# EAGLE design PWR (EAGLE 6.4)
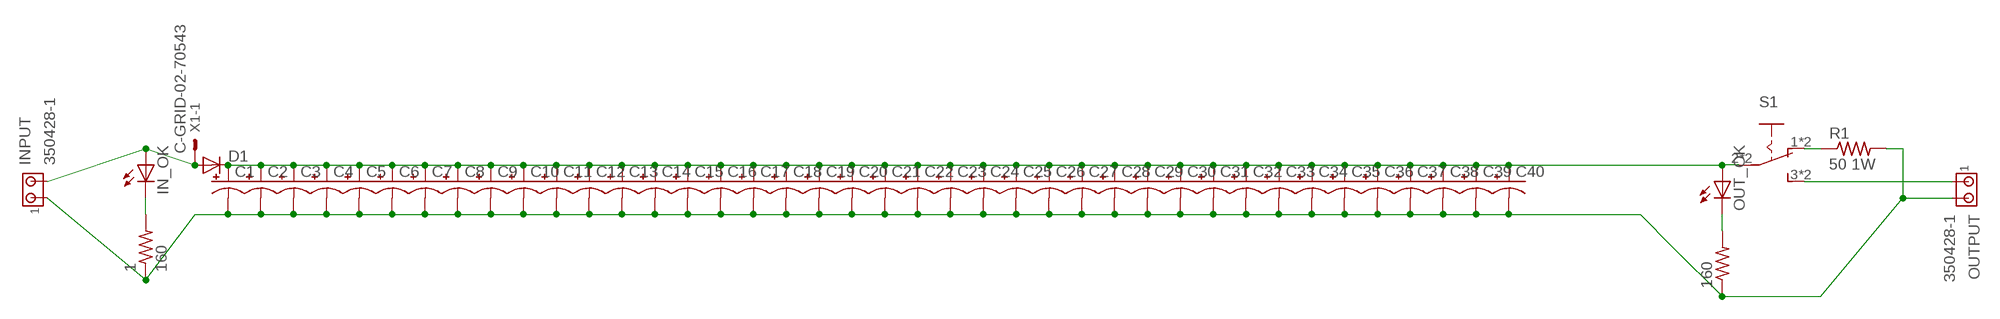
[diagram p0: schematic, sheet 1]

## Parts
1  160  R-US_R1206  [R1206]
160  R-US_R1206  [R1206]
C1  CPOL-USE5-10.5  [E5-10,5]
C2  CPOL-USE5-10.5  [E5-10,5]
C3  CPOL-USE5-10.5  [E5-10,5]
C4  CPOL-USE5-10.5  [E5-10,5]
C5  CPOL-USE5-10.5  [E5-10,5]
C6  CPOL-USE5-10.5  [E5-10,5]
C7  CPOL-USE5-10.5  [E5-10,5]
C8  CPOL-USE5-10.5  [E5-10,5]
C9  CPOL-USE5-10.5  [E5-10,5]
C10  CPOL-USE5-10.5  [E5-10,5]
C11  CPOL-USE5-10.5  [E5-10,5]
C12  CPOL-USE5-10.5  [E5-10,5]
C13  CPOL-USE5-10.5  [E5-10,5]
C14  CPOL-USE5-10.5  [E5-10,5]
C15  CPOL-USE5-10.5  [E5-10,5]
C16  CPOL-USE5-10.5  [E5-10,5]
C17  CPOL-USE5-10.5  [E5-10,5]
C18  CPOL-USE5-10.5  [E5-10,5]
C19  CPOL-USE5-10.5  [E5-10,5]
C20  CPOL-USE5-10.5  [E5-10,5]
C21  CPOL-USE5-10.5  [E5-10,5]
C22  CPOL-USE5-10.5  [E5-10,5]
C23  CPOL-USE5-10.5  [E5-10,5]
C24  CPOL-USE5-10.5  [E5-10,5]
C25  CPOL-USE5-10.5  [E5-10,5]
C26  CPOL-USE5-10.5  [E5-10,5]
C27  CPOL-USE5-10.5  [E5-10,5]
C28  CPOL-USE5-10.5  [E5-10,5]
C29  CPOL-USE5-10.5  [E5-10,5]
C30  CPOL-USE5-10.5  [E5-10,5]
C31  CPOL-USE5-10.5  [E5-10,5]
C32  CPOL-USE5-10.5  [E5-10,5]
C33  CPOL-USE5-10.5  [E5-10,5]
C34  CPOL-USE5-10.5  [E5-10,5]
C35  CPOL-USE5-10.5  [E5-10,5]
C36  CPOL-USE5-10.5  [E5-10,5]
C37  CPOL-USE5-10.5  [E5-10,5]
C38  CPOL-USE5-10.5  [E5-10,5]
C39  CPOL-USE5-10.5  [E5-10,5]
C40  CPOL-USE5-10.5  [E5-10,5]
D1  DIODE-SOD123  [SOD123]
IN_OK  LEDCHIPLED_1206  [CHIPLED_1206]
INPUT  350428-1  [350428-1]
OUT_OK  LEDCHIPLED_1206  [CHIPLED_1206]
OUTPUT  350428-1  [350428-1]
R1  50 1W  R-US_WSC2515  [WSC2515]
S1  M251  [SLIDE_SWITCH]
X1  C-GRID-02-70543  [70543-02]

## Nets
5V: C1.+ C2.+ C3.+ C4.+ C5.+ C6.+ C7.+ C8.+ C9.+ C10.+ C11.+ C12.+ C13.+ C14.+ C15.+ C16.+ C17.+ C18.+ C19.+ C20.+ C21.+ C22.+ C23.+ C24.+ C25.+ C26.+ C27.+ C28.+ C29.+ C30.+ C31.+ C32.+ C33.+ C34.+ C35.+ C36.+ C37.+ C38.+ C39.+ C40.+ D1.C OUT_OK.A S1.2(P) S1.5(P)
GND: 1.1 160.1 C1.- C2.- C3.- C4.- C5.- C6.- C7.- C8.- C9.- C10.- C11.- C12.- C13.- C14.- C15.- C16.- C17.- C18.- C19.- C20.- C21.- C22.- C23.- C24.- C25.- C26.- C27.- C28.- C29.- C30.- C31.- C32.- C33.- C34.- C35.- C36.- C37.- C38.- C39.- C40.- INPUT.1 OUTPUT.2 R1.2
N$1: R1.1 S1.1(O) S1.6(O)
N$2: 1.2 IN_OK.C
N$4: 160.2 OUT_OK.C
N$5: OUTPUT.1 S1.3(S) S1.4(S)
N$6: D1.A IN_OK.A INPUT.2 X1.1
Unconnected: X1.2

## Library data of the parts
1 160 R1 = rcl:R-US_: RESISTOR, American symbol
C1-C40 = rcl:CPOL-US: POLARIZED CAPACITOR, American symbol
D1 = diode:DIODE-: DIODE
IN_OK OUT_OK = led:LED: LED OSRAM: - CHIPLED LG R971, LG N971, LY N971, LG Q971, LY Q971, LO R971, LY R971 LH N974, LH R974 LS Q976, LO Q976, LY Q976 LO Q996 - Hyper CHIPLED LW Q18S LB Q993, LB Q99A, LB R99A - SideLED LS A670, LO A670, LY A670, LG A670, LP A670 LB A673, LV A673, LT A673, LW A673 LH A674 LY A675 LS A676, LA A676, LO A676, LY A676, LW A676 LS A679, LY A679, LG A679 - Hyper Micro SIDELED® LS Y876, LA Y876, LO Y876, LY Y876 LT Y87S - SmartLED LW L88C, LW L88S LB L89C, LB L89S, LG L890 LS L89K, LO L89K, LY L89K LS L896, LA L896, LO L896, LY L896 - TOPLED LS T670, LO T670, LY T670, LG T670, LP T670 LSG T670, LSP T670, LSY T670, LOP T670, LYG T670 LG T671, LOG T671, LSG T671 LB T673, LV T673, LT T673, LW T673 LH T674 LS T676, LA T676, LO T676, LY T676, LB T676, LH T676, LSB T676, LW T676 LB T67C, LV T67C, LT T67C, LS T67K, LO T67K, LY T67K, LW E67C LS E67B, LA E67B, LO E67B, LY E67B, LB E67C, LV E67C, LT E67C LW T67C LS T679, LY T679, LG T679 LS T770, LO T770, LY T770, LG T770, LP T770 LB T773, LV T773, LT T773, LW T773 LH T774 LS E675, LA E675, LY E675, LS T675 LS T776, LA T776, LO T776, LY T776, LB T776 LHGB T686 LT T68C, LB T68C - Hyper Mini TOPLED® LB M676 - Mini TOPLED Santana® LG M470 LS M47K, LO M47K, LY M47K Source: http://www.osram.convergy.de LUXEON: - LUMILED® LXK2-PW12-R00, LXK2-PW12-S00, LXK2-PW14-U00, LXK2-PW14-V00 LXK2-PM12-R00, LXK2-PM12-S00, LXK2-PM14-U00 LXK2-PE12-Q00, LXK2-PE12-R00, LXK2-PE12-S00, LXK2-PE14-T00, LXK2-PE14-U00 LXK2-PB12-K00, LXK2-PB12-L00, LXK2-PB12-M00, LXK2-PB14-N00, LXK2-PB14-P00, LXK2-PB14-Q00 LXK2-PR12-L00, LXK2-PR12-M00, LXK2-PR14-Q00, LXK2-PR14-R00 LXK2-PD12-Q00, LXK2-PD12-R00, LXK2-PD12-S00 LXK2-PH12-R00, LXK2-PH12-S00 LXK2-PL12-P00, LXK2-PL12-Q00, LXK2-PL12-R00 Source: www.luxeon.com KINGBRIGHT: KA-3528ASYC Source: www.kingbright.com
INPUT OUTPUT = con-amp:350428-1: Universal MATE-N-LOK .250" Centerline, 600 V, 19 - 36 A max Source: http://catalog.tycoelectronics.com/ .. ENG_CD_350428_Y.pdf
S1 = SolarJackets_Common:M251: SLIDING SWITCH Mors, distributor Buerklin, 11G702
X1 = con-molex:C-GRID-02: CONNECTOR wire to board 2.54 mm (0.100") pitch header; OC_FARNELL: unknown; OC_NEWARK: unknown

## Board
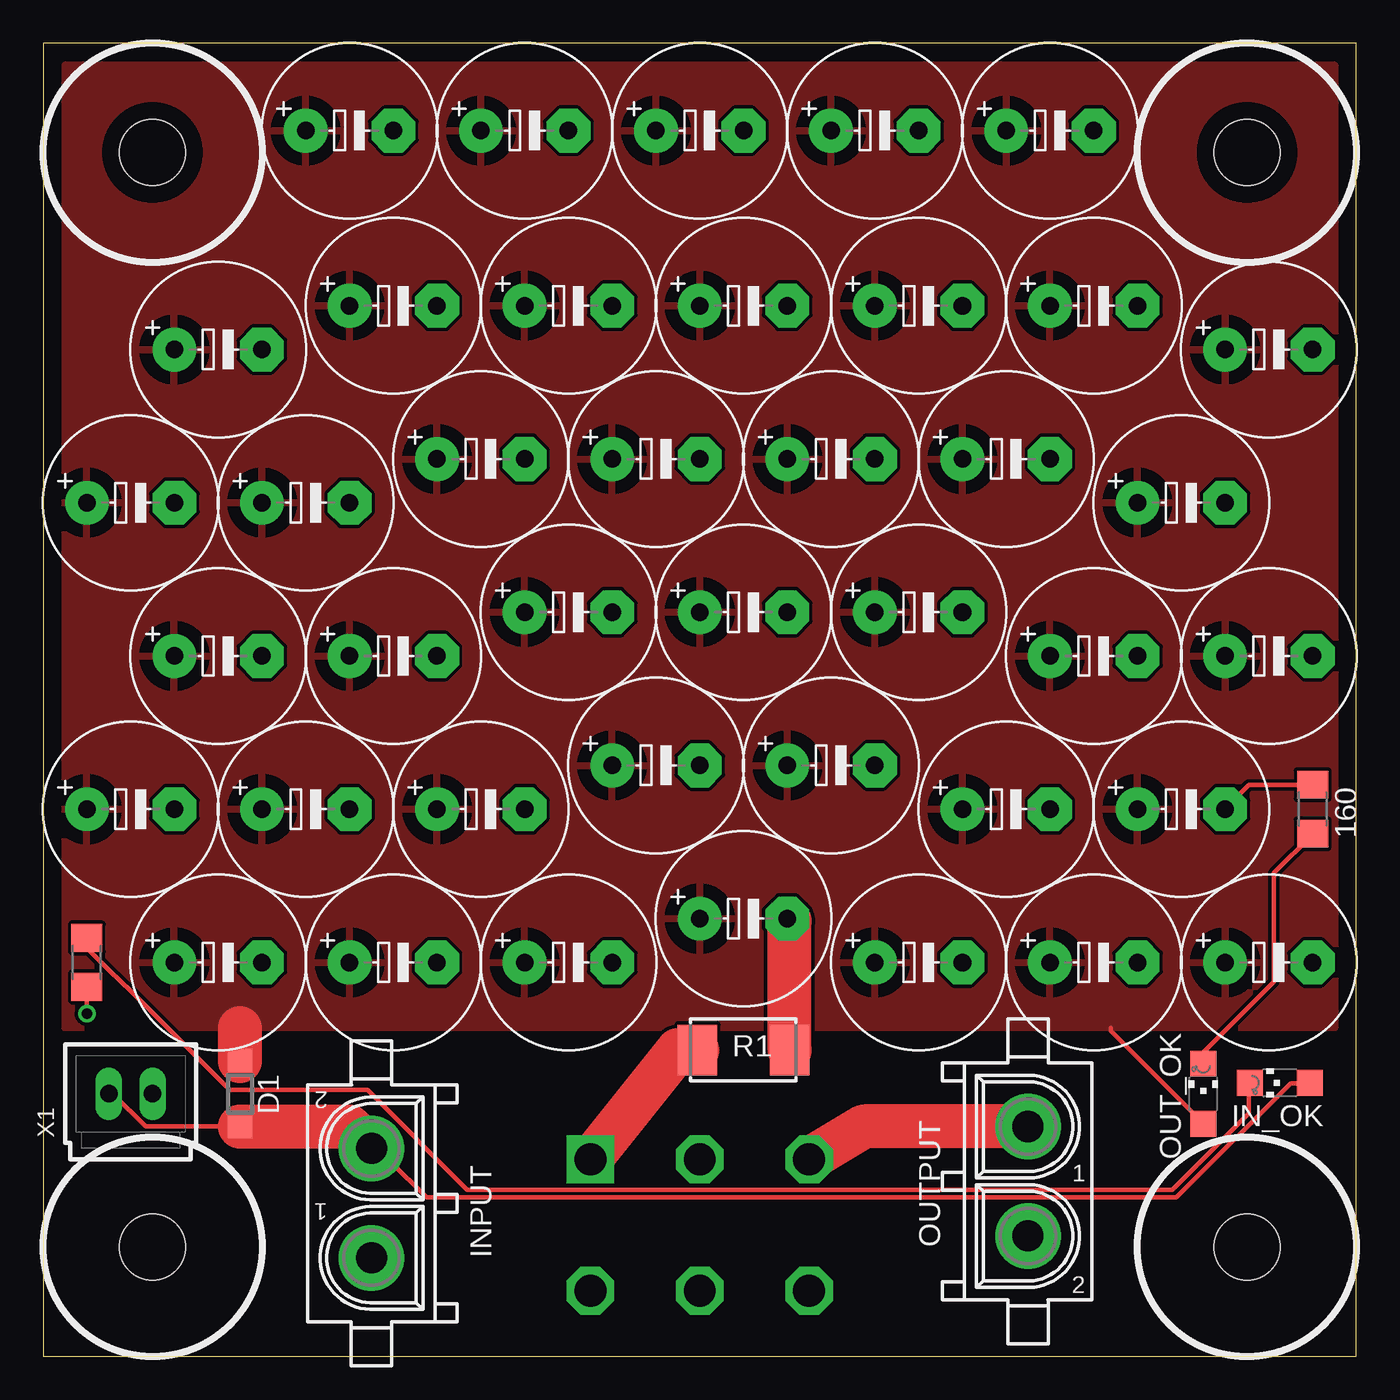
[diagram p1: board, top side]
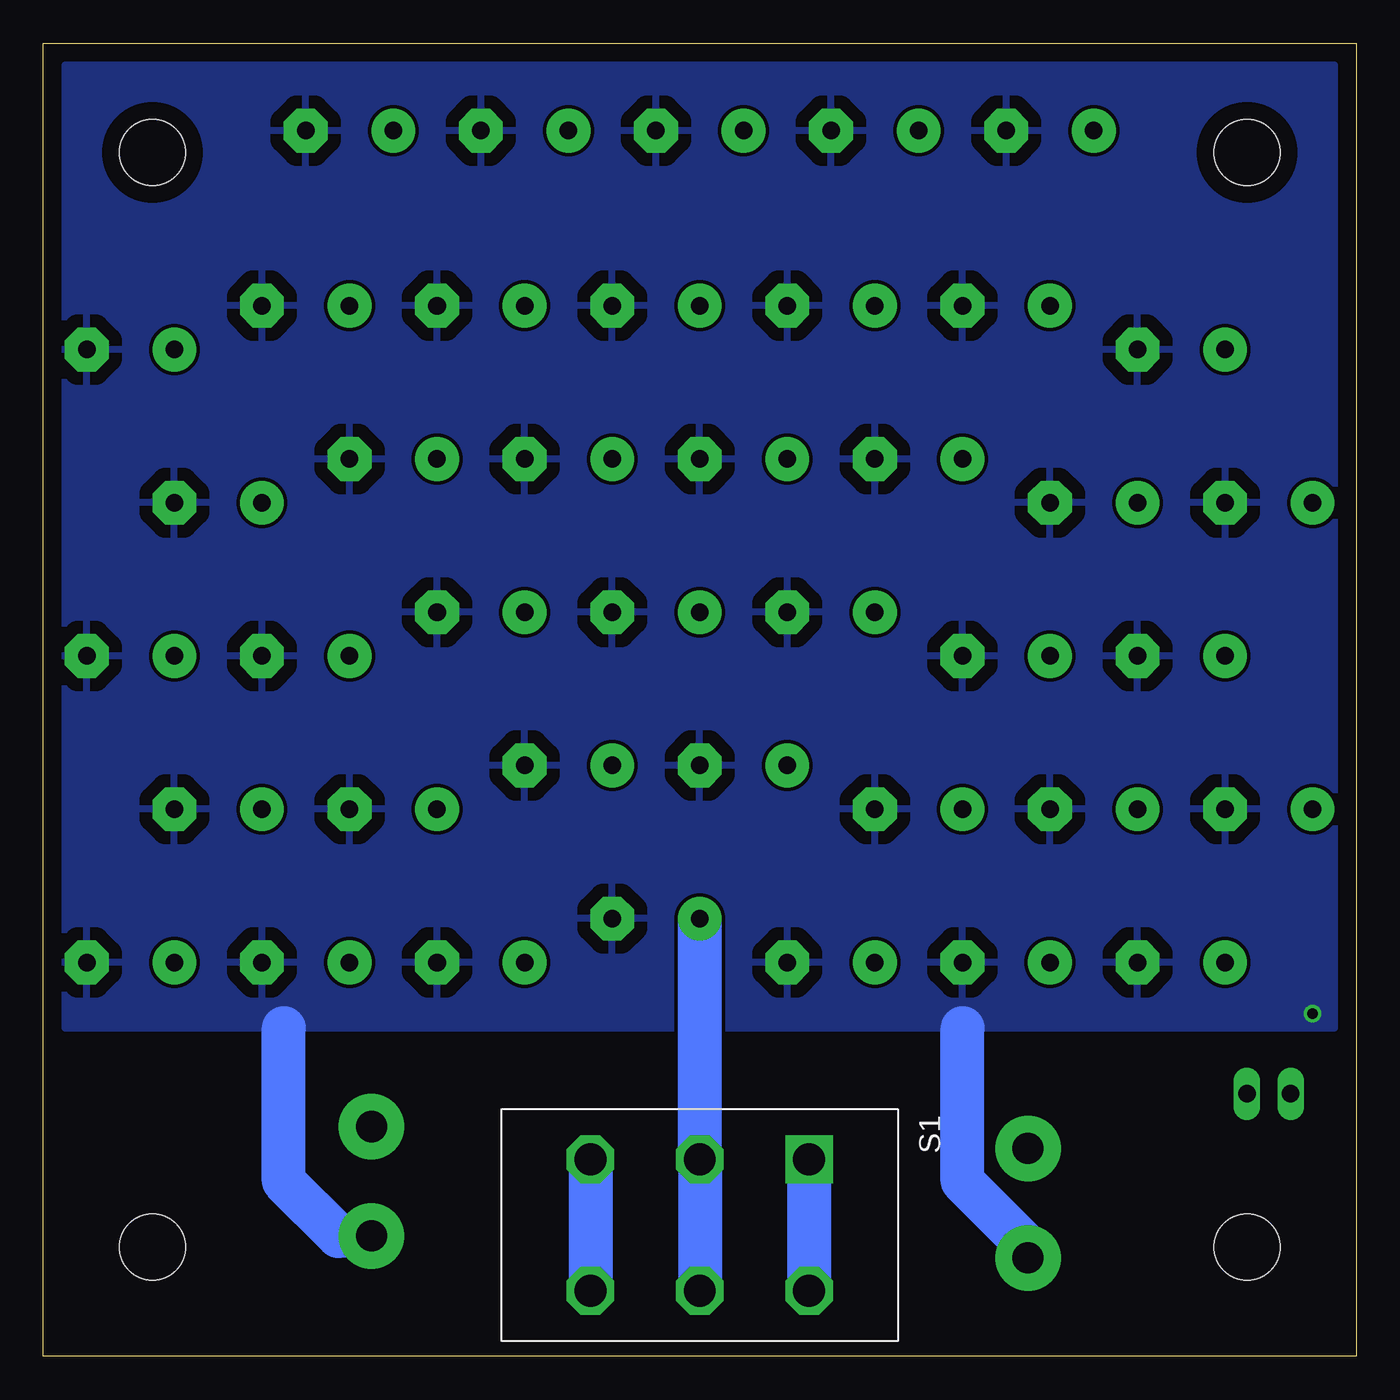
[diagram p2: board, bottom side, seen from below]

Size 76.2 x 76.2 mm. Coordinates in mm from the lower left corner, seen from the top.
Outline: 0,0 76.2,0 76.2,76.2 0,76.2 0,0
Copper layers (1*16): Top 0.035mm / dielectric 1.5mm / Bottom 0.035mm
Design rules "default *": minimum track width 10mil, minimum drill 24mil, track to track 8mil, track to pad 8mil, pad to pad 8mil, via to via 8mil, smd to smd 8mil, copper to edge 40mil, drill to drill 8mil, minimum pad ring 10mil, minimum via ring 8mil, stop-mask expansion 4mil, vias tented up to drill 0mil, thermal gap 30mil
Holes 3.81 mm at 6.35,6.35 6.35,69.85 69.85,69.85 69.85,6.35

### Footprints (pad centres in the part's own frame; a part is rotated, then mirrored left to right if it is on the bottom)
R1206 = smd 1.6 x 1.803: 1 -1.422,0; 2 1.422,0
E5-10,5 = drill 1.016 pad 2.54: + -2.54,0 | drill 1.016 pad 2.54 octagon: - 2.54,0
SOD123 = smd 1.4 x 1.4: A 1.9,0; C -1.9,0
CHIPLED_1206 = smd 1.5 x 1.5: A 0,-1.75; C 0,1.75
350428-1 = drill 1.8 pad 3.81: 1 -3.175,0; 2 3.175,0
WSC2515 = smd 2.29 x 2.92: 1 -2.675,0; 2 2.675,0
SLIDE_SWITCH = drill 1.854 square: 1 -3.81,6.35 | drill 1.854 octagon: 2 -3.81,0; 3 -3.81,-6.35; 4 3.81,-6.35; 5 3.81,0; 6 3.81,6.35
70543-02 = drill 1.016 long: 1 -1.27,0; 2 1.27,0

### Placement (x,y rotation side)
1  2.54,22.86 90 top
160  73.66,31.75 270 top
C1  17.78,71.12 0 top
C2  27.94,71.12 0 top
C3  38.1,71.12 0 top
C4  48.26,71.12 0 top
C5  58.42,71.12 0 top
C6  71.12,58.42 0 top
C7  60.96,60.96 0 top
C8  50.8,60.96 0 top
C9  40.64,60.96 0 top
C10  30.48,60.96 0 top
C11  20.32,60.96 0 top
C12  10.16,58.42 0 top
C13  5.08,49.53 0 top
C14  15.24,49.53 0 top
C15  25.4,52.07 0 top
C16  35.56,52.07 0 top
C17  45.72,52.07 0 top
C18  55.88,52.07 0 top
C19  66.04,49.53 0 top
C20  71.12,40.64 0 top
C21  60.96,40.64 0 top
C22  50.8,43.18 0 top
C23  40.64,43.18 0 top
C24  30.48,43.18 0 top
C25  20.32,40.64 0 top
C26  10.16,40.64 0 top
C27  5.08,31.75 0 top
C28  15.24,31.75 0 top
C29  25.4,31.75 0 top
C30  35.56,34.29 0 top
C31  45.72,34.29 0 top
C32  55.88,31.75 0 top
C33  66.04,31.75 0 top
C34  71.12,22.86 0 top
C35  60.96,22.86 0 top
C36  50.8,22.86 0 top
C37  40.64,25.4 0 top
C38  30.48,22.86 0 top
C39  20.32,22.86 0 top
C40  10.16,22.86 0 top
D1  11.43,15.24 270 top
IN_OK  71.75,15.88 90 top
INPUT  19.05,8.89 90 top
OUT_OK  67.31,15.24 0 top
OUTPUT  57.15,10.16 270 top
R1  40.64,17.78 0 top
S1  38.1,7.62 270 bottom
X1  5.08,15.24 0 top

### Tracks (layer width: path | path; a pad name or v marks a point on that pad's centre or on a via)
5V
  Top 0.254: OUT_OK.A 67.28,13.56 61.95,18.9 61.95,19.05
  Top 2.54: D1.C 11.43,19.05
  Bottom 2.54: C37.+ S1.2 S1.5
  pour Top: 1.27,74.93 74.93,74.93 74.93,19.05 1.27,19.05 1.27,73.66
GND  (via drill 0.61)
  Top 0.254: v2.54,19.89 2.54,21.41 1.1 | 160.1 73.61,33.15 69.95,33.15 68.58,31.77 C33.-
  Top 2.54: R1.2 43.31,25.27 C37.-
  Bottom 2.54: OUTPUT.2 59.05,6.99 62.23,10.16 62.23,19.05 | INPUT.1 19.05,6.35 22.86,10.16 22.86,19.05
  pour Bottom: 1.27,74.93 74.93,74.93 74.93,19.05 1.27,19.05
N$1
  Top 2.54: R1.1 36.83,17.78 S1.1
  Bottom 2.54: S1.1 S1.6
N$2
  Top 0.254: IN_OK.C 69.95,15.85 69.95,14.1 65.53,9.68 24.61,9.68 18.82,15.47 10.82,15.47 5.11,21.18 3.83,22.4 2.54,23.7 2.54,24.23 1.2
N$4
  Top 0.254: OUT_OK.C 67.36,16.99 67.36,17.68 71.4,21.72 71.4,28.04 73.69,30.33 160.2
N$5
  Top 2.54: OUTPUT.1 47.62,13.34 S1.3
  Bottom 2.54: S1.3 S1.4
N$6
  Top 0.254: IN_OK.A 73.46,15.85 72.39,15.85 65.76,9.22 22.25,9.22 20.12,11.35 INPUT.2 | X1.1 4.04,15.24 5.94,13.34 10.21,13.34 D1.A
  Top 2.54: D1.A 17.77,13.34 INPUT.2

### Text on the board
tValues: + | + | - | -
bValues: SOLAR JACKETS / TS-7800 POWER BANK / 2/25/13 REV1